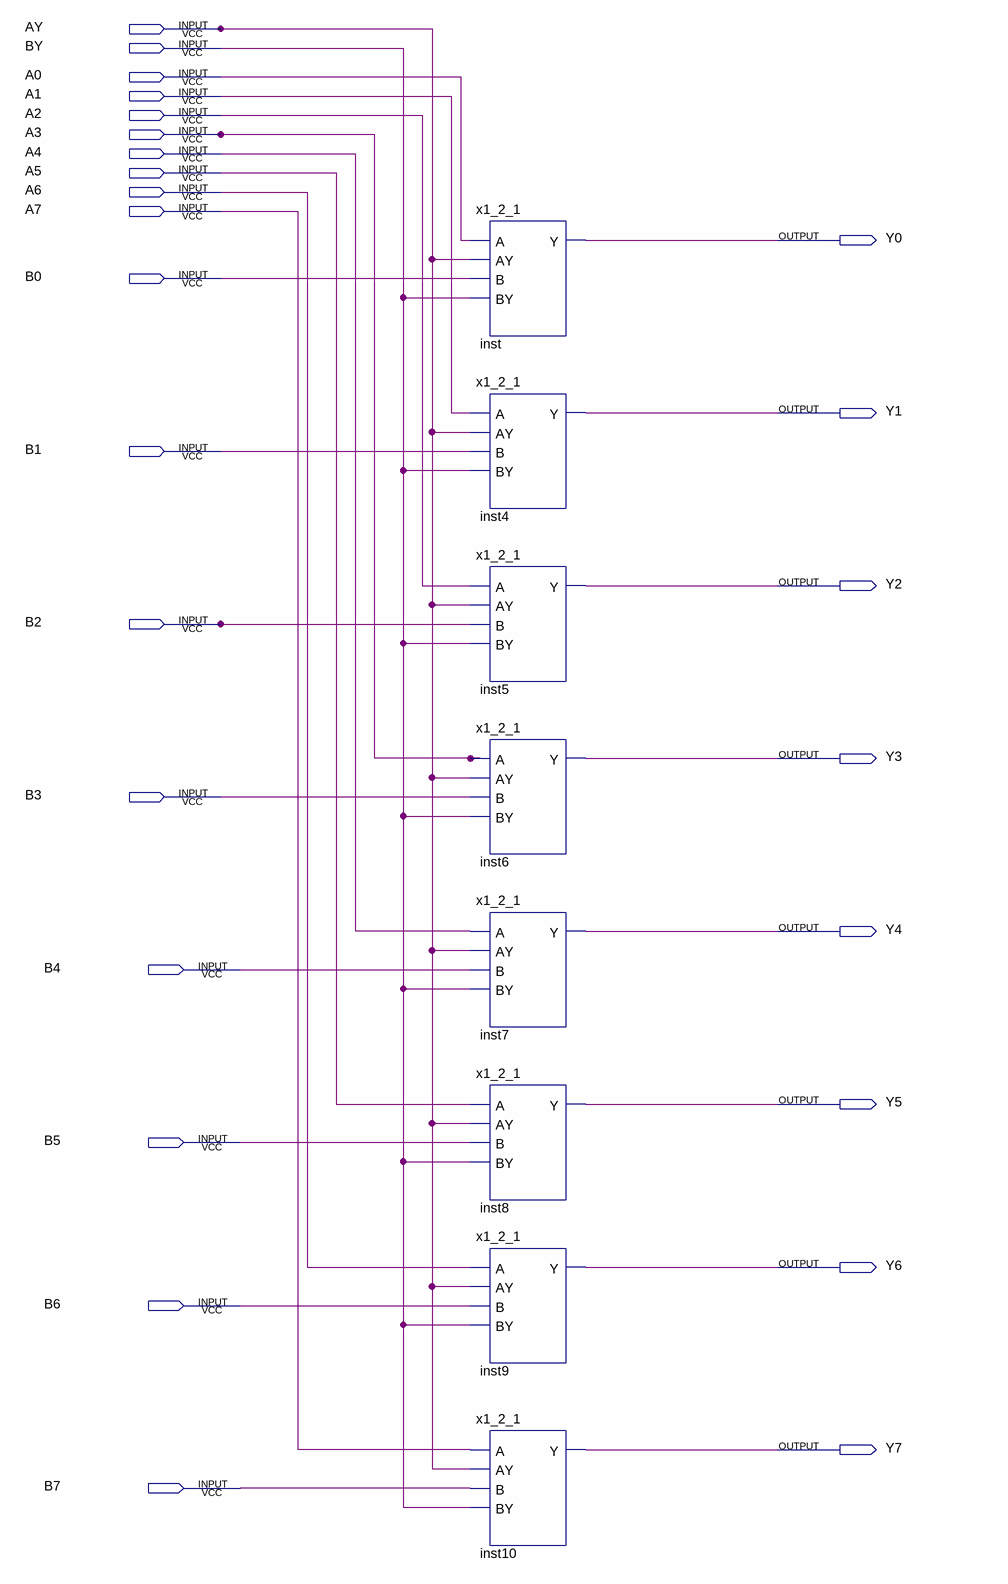
[diagram p0: schematic sheet]
// Quartus schematic x8_2_1.bdf as structural Verilog: 8 symbols, 26 pins
module x8_2_1 (
  input  AY,
  input  BY,
  input  A0,
  input  A1,
  input  A2,
  input  A3,
  input  A4,
  input  A5,
  input  A6,
  input  A7,
  input  B0,
  input  B1,
  input  B2,
  input  B3,
  input  B4,
  input  B5,
  input  B6,
  input  B7,
  output Y0,
  output Y1,
  output Y2,
  output Y3,
  output Y4,
  output Y5,
  output Y6,
  output Y7
);

  x1_2_1 inst (.A(A0), .AY(AY), .B(B0), .BY(BY), .Y(Y0));
  x1_2_1 inst4 (.A(A1), .AY(AY), .B(B1), .BY(BY), .Y(Y1));
  x1_2_1 inst5 (.A(A2), .AY(AY), .B(B2), .BY(BY), .Y(Y2));
  x1_2_1 inst6 (.A(A3), .AY(AY), .B(B3), .BY(BY), .Y(Y3));
  x1_2_1 inst7 (.A(A4), .AY(AY), .B(B4), .BY(BY), .Y(Y4));
  x1_2_1 inst8 (.A(A5), .AY(AY), .B(B5), .BY(BY), .Y(Y5));
  x1_2_1 inst9 (.A(A6), .AY(AY), .B(B6), .BY(BY), .Y(Y6));
  x1_2_1 inst10 (.A(A7), .AY(AY), .B(B7), .BY(BY), .Y(Y7));
endmodule
